# Altium project LPHR_WeatherStationPCB.PrjPcb (part 1 of 3)
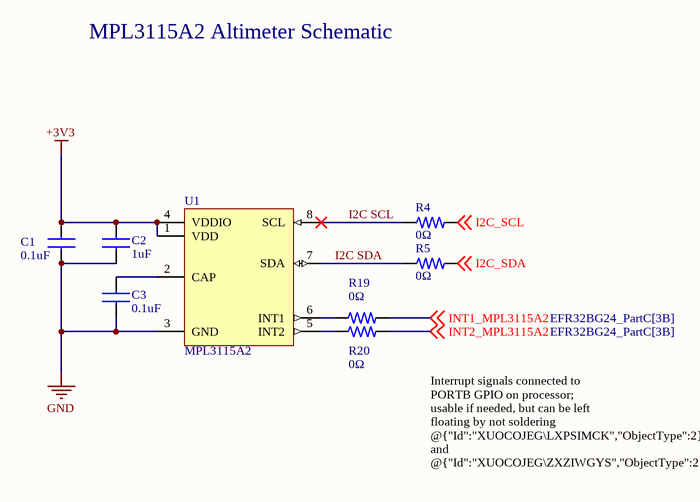
[diagram p0: MPL3115A2.SchDoc]
7 sheets, 99 parts. Net scope: flat (ports and power ports of the same name join across sheets).
Board file: PCB_WeatherStation.PcbDoc
Sheets:
  MPL3115A2.SchDoc
  AS7331.SchDoc
  Si7021.SchDoc
  BQ25570.SchDoc
  EFR32BG24_PartB.SchDoc
  EFR32BG24_PartC.SchDoc
  EFR32BG24_PartA.SchDoc

## Sheet MPL3115A2.SchDoc: LPEDT_Project_Schematic
size A; DocumentNumber: 1; Revision: 1; SheetNumber: 1; SheetTotal: 7

### Parts
C1  0.1uF  [C_0603]
C2  1uF  [C_0603]
C3  0.1uF  [C_0603]
R4  0Ω  [R_0603]
R5  0Ω  [R_0603]
R19  0Ω  [R_0603]
R20  0Ω  [R_0603]
U1  MPL3115A2  [U_MPL3115A2]

### Nets
+3V3: C1.1 C2.2 U1.1(VDD) U1.4(VDDIO)
GND: C1.2 C2.1 C3.2 U1.3(GND)
I2C SCL: R4.1 U1.8(SCL)
I2C SDA: R5.1 U1.7(SDA)
I2C_SCL: R4.2 ; off-sheet I2C_SCL
I2C_SDA: R5.2 ; off-sheet I2C_SDA
INT1_MPL3115A2: R19.2 ; off-sheet INT1_MPL3115A2
INT2_MPL3115A2: R20.2 ; off-sheet INT2_MPL3115A2
NetC3_1: C3.1 U1.2(CAP)
NetR19_1: R19.1 U1.6(INT1)
NetR20_1: R20.1 U1.5(INT2)

### Notes on the sheet
- MPL3115A2 Altimeter Schematic
- Interrupt signals connected to PORTB GPIO on processor; usable if needed, but can be left floating by not soldering @{"Id":"XUOCOJEG\LXPSIMCK","ObjectType":2} and @{"Id":"XUOCOJEG\ZXZIWGYS","ObjectType":2}.

### Library data of the parts
C1 C3 = C_0.1U_0603: CAP CER 0.1UF 10V X5R 0603; Manufacturer: KEMET; Manufacturer Part Number: C0603C104K8PAC7867; Dielectric Material: Ceramic; Supplier: Digikey; Supplier Part Number: 399-17573-1-ND; RoHS: Yes; Category: Ceramic Capacitors; Stock: 13122; Pricing: 1=0.18, 10=0.119, 50=0.075, 100=0.06, 500=0.04332, 1000=0.03833 (USD); Pins: 2; Capacitor Type: Ceramic; Reach SVHC Compliant: Yes; RoHS Compliant: Yes; ComponentLink1URL: https://datasheet.ciiva.com:443/pdfs/VipMasterIC/IC/KEME/KEME-S-A0007617622/KEME-S-A0007611556-1.pdf?src-supplier=IHS+Markit; ComponentLink1Description: https://datasheet.ciiva.com:443/pdfs/VipMasterIC/IC/KEME/KEME-S-A0007617622/KEME-S-A0007611556-1.pdf?src-supplier=IHS+Markit; ComponentLink2URL: https://api.kemet.com/component-edge/download/datasheet/C0603C104K8PAC7867.pdf?src-supplier=Digikey; ComponentLink2Description: https://api.kemet.com/component-edge/download/datasheet/C0603C104K8PAC7867.pdf?src-supplier=Digikey
C2 = C_1U_0603: CAP CER 1UF 10V X5R 0603; Manufacturer: Murata; Manufacturer Part Number: GRM188R61A105KA61D; Dielectric Material: Ceramic; Multilayer: Yes; Tolerance  (fill in as +-): 10%; Supplier: Digikey; Supplier Part Number: 490-1543-1-ND; RoHS: Yes; Category: Ceramic Capacitors; Stock: 1314759; Pricing: 1=0.12, 10=0.08, 50=0.048, 100=0.0378, 500=0.02794, 1000=0.02313 (USD); Mounting Technology: Surface Mount; Pins: 2; Package Shape: Rectangular; Case/Package: 0603; Terminal Finish: Nickel; Min Operating Temperature: -55°C; Max Operating Temperature: 85°C; JESD-609 Code: e3; Value: 1uF; Capacitor Type: Ceramic; Package Style: SMTMeter; Packaging: Tape and Reel; Tolerance (fill in as +-): 10%; Rated DC Voltage (URdc): 10V; Temperature Characteristics Code: X5R; Termination: Wraparound; Length: 1.6mm; Width: 0.8mm; Height: 0.8mm; Reach SVHC Compliant: Yes; RoHS Compliant: Yes; ComponentLink1URL: https://psearch.en.murata.com:443/capacitor/product/GRM188R61A105KA61%23.pdf?src-supplier=IHS+Markit; ComponentLink1Description: https://psearch.en.murata.com:443/capacitor/product/GRM188R61A105KA61%23.pdf?src-supplier=IHS+Markit; ComponentLink2URL: https://datasheet.ciiva.com/19476/1857381-19476568.pdf?src-supplier=Jameco; ComponentLink2Description: https://datasheet.ciiva.com/19476/1857381-19476568.pdf?src-supplier=Jameco; ComponentLink3URL: https://datasheet.ciiva.com/18102/getdatasheetpartid-85467-18102910.pdf?src-supplier=Verical; ComponentLink3Description: https://datasheet.ciiva.com/18102/getdatasheetpartid-85467-18102910.pdf?src-supplier=Verical; ComponentLink4URL: https://datasheet.ciiva.com/7719/608985-7719036.pdf?src-supplier=Element14; ComponentLink4Description: https://datasheet.ciiva.com/7719/608985-7719036.pdf?src-supplier=Element14; ComponentLink5URL: https://datasheet.ciiva.com/22706/608985-22706782.pdf?src-supplier=Element14; ComponentLink5Description: https://datasheet.ciiva.com/22706/608985-22706782.pdf?src-supplier=Element14; ComponentLink6URL: https://datasheet.ciiva.com/131/partnumbering-e-01-131742.pdf?src-supplier=Digikey; ComponentLink6Description: https://datasheet.ciiva.com/131/partnumbering-e-01-131742.pdf?src-supplier=Digikey; ComponentLink7URL: https://datasheet.ciiva.com/131/partnumbering-e-01-131741.pdf?src-supplier=Digikey; ComponentLink7Description: https://datasheet.ciiva.com/131/partnumbering-e-01-131741.pdf?src-supplier=Digikey; ComponentLink8URL: https://datasheet.ciiva.com/131/partnumbering-e-01-131743.pdf?src-supplier=Digikey; ComponentLink8Description: https://datasheet.ciiva.com/131/partnumbering-e-01-131743.pdf?src-supplier=Digikey; ComponentLink9URL: https://datasheet.ciiva.com/16199/product-16199724.pdf?src-supplier=Future+Electronics; ComponentLink9Description: https://datasheet.ciiva.com/16199/product-16199724.pdf?src-supplier=Future+Electronics
R4 R5 R19 R20 = R_0_0603: RES 0OHM 0.1W 0603; Manufacturer: Stackpole Electronics; Manufacturer Part Number: RMCF0603ZT0R00; Power: 100mW; Rated Temperature: 70°C; Value: 0R; Working Voltage: 75V; Package Height: 0.45mm; Package Length: 1.55mm; Package Width: 0.8mm; Reference Standard: AEC-Q200; Supplier: Digikey; Supplier Part Number: RMCF0603ZT0R00CT-ND; RoHS: Yes; Category: Chip SMD Resistors; Stock: 13173551; Pricing: 1=0.1, 10=0.013, 25=0.0096, 50=0.0072, 100=0.0051, 250=0.00408, 500=0.00328, 1000=0.00241 (USD); Mounting Technology: Surface Mount; Pins: 2; Package Shape: Rectangular; Case/Package: 0603; Terminal Finish: Nickel; Min Operating Temperature: -55°C; Max Operating Temperature: 155°C; JESD-609 Code: e3; Resistor Type: FIXED RESISTOR; Construction: Rectangular; Package Style: SMTMeter; Packaging: Tape and Reel; Technology: METAL GLAZE/THICK FILM; Termination: Wraparound; Reach SVHC Compliant: Yes; RoHS Compliant: Yes; ComponentLink1URL: https://datasheet.ciiva.com:443/pdfs/VipMasterIC/IC/SEIE/SEIE-S-A0007077258/SEIE-S-A0007077258-1.pdf?src-supplier=IHS+Markit; ComponentLink1Description: https://datasheet.ciiva.com:443/pdfs/VipMasterIC/IC/SEIE/SEIE-S-A0007077258/SEIE-S-A0007077258-1.pdf?src-supplier=IHS+Markit; ComponentLink2URL: https://datasheet.octopart.com/RMCF0603ZT0R00-Stackpole-Electronics-datasheet-11547379.pdf?src-supplier=Future+Electronics; ComponentLink2Description: https://datasheet.octopart.com/RMCF0603ZT0R00-Stackpole-Electronics-datasheet-11547379.pdf?src-supplier=Future+Electronics; ComponentLink3URL: https://www.seielect.com/catalog/SEI-Packaging.pdf?src-supplier=Avnet; ComponentLink3Description: https://www.seielect.com/catalog/SEI-Packaging.pdf?src-supplier=Avnet; ComponentLink4URL: https://www.seielect.com/catalog/SEI-Packaging.pdf?src-supplier=Arrow+Electronics; ComponentLink4Description: https://www.seielect.com/catalog/SEI-Packaging.pdf?src-supplier=Arrow+Electronics; ComponentLink5URL: https://www.seielect.com/catalog/SEI-Packaging.pdf?src-supplier=Verical; ComponentLink5Description: https://www.seielect.com/catalog/SEI-Packaging.pdf?src-supplier=Verical; ComponentLink6URL: https://datasheet.octopart.com/RMCF0603ZT0R00-Stackpole-Electronics-datasheet-154799224.pdf?src-supplier=Master+Electronics; ComponentLink6Description: https://datasheet.octopart.com/RMCF0603ZT0R00-Stackpole-Electronics-datasheet-154799224.pdf?src-supplier=Master+Electronics
U1 = U_MPL3115A2: Pressure Sensor 7.25PSI ~ 15.95PSI (50kPa ~ 110kPa) Absolute 24 b 8-TLGA

## Sheet AS7331.SchDoc: LPEDT_Project_Schematic
size A; Revision: 1; SheetNumber: 2; SheetTotal: 7
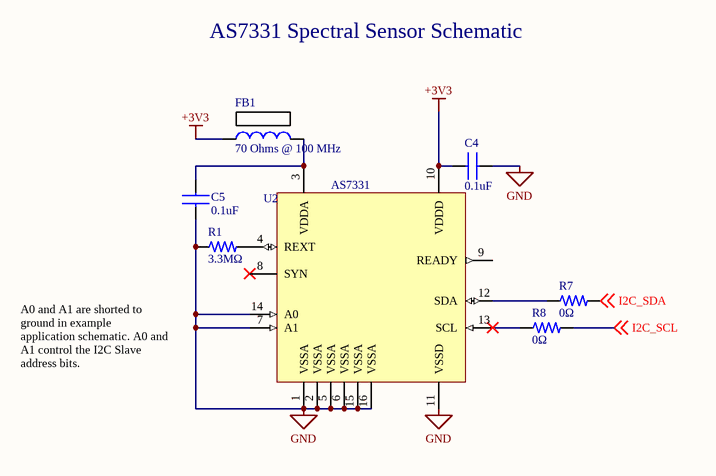
[diagram p1: AS7331.SchDoc]

### Parts
C4  0.1uF  [C_0603]
C5  0.1uF  [C_0603]
FB1  70 Ohms @ 100 MHz  [FB_0603]
R1  3.3MΩ  [R_0603]
R7  0Ω  [R_0603]
R8  0Ω  [R_0603]
U2  AS7331  [U_AS7331]

### Nets
+3V3: C4.2 FB1.1 U2.10(VDDD)
GND: C4.1 C5.2 R1.1 U2.1(VSSA) U2.2(VSSA) U2.5(VSSA) U2.6(VSSA) U2.7(A1) U2.11(VSSD) U2.14(A0) U2.15(VSSA) U2.16(VSSA)
I2C_SCL: R8.2 ; off-sheet I2C_SCL
I2C_SDA: R7.2 ; off-sheet I2C_SDA
NetC5_1: C5.1 FB1.2 U2.3(VDDA)
NetR1_2: R1.2 U2.4(REXT)
NetR7_1: R7.1 U2.12(SDA)
NetR8_1: R8.1 U2.13(SCL)

Not connected (* = marked no-connect by the designer): U2 8(SYN)* 9(READY)

### Notes on the sheet
- AS7331 Spectral Sensor Schematic
- A0 and A1 are shorted to ground in example application schematic. A0 and A1 control the I2C Slave address bits.

### Library data of the parts
C4 C5 = C_0.1U_0603: as C1 on sheet MPL3115A2; Supplier: Digikey; Supplier Part Number: 399-17573-1-ND; RoHS: Yes; Category: Ceramic Capacitors; Stock: 13122; Pricing: 1=0.18, 10=0.119, 50=0.075, 100=0.06, 500=0.04332, 1000=0.03833 (USD); Pins: 2; Capacitor Type: Ceramic; Reach SVHC Compliant: Yes; RoHS Compliant: Yes; ComponentLink1URL: https://datasheet.ciiva.com:443/pdfs/VipMasterIC/IC/KEME/KEME-S-A0007617622/KEME-S-A0007611556-1.pdf?src-supplier=IHS+Markit; ComponentLink1Description: https://datasheet.ciiva.com:443/pdfs/VipMasterIC/IC/KEME/KEME-S-A0007617622/KEME-S-A0007611556-1.pdf?src-supplier=IHS+Markit; ComponentLink2URL: https://api.kemet.com/component-edge/download/datasheet/C0603C104K8PAC7867.pdf?src-supplier=Digikey; ComponentLink2Description: https://api.kemet.com/component-edge/download/datasheet/C0603C104K8PAC7867.pdf?src-supplier=Digikey
FB1 = BLM18SG700TN1D: Ferrite Chip, 1 Function(s), 4A, 2 Pin(s); Manufacturer: Murata; DC Resistance-Max: 20mR; Clock Frequency: 100MHz; Channels: 1; Output Impedance: 70R; Supplier: Digikey; Supplier Part Number: 490-5224-1-ND; Manufacturer Part Number: BLM18SG700TN1D; RoHS: Yes; Category: Ferrite Beads and Chips; Stock: 330015; Pricing: 1=0.13, 10=0.109, 25=0.0848, 50=0.0702, 100=0.0605, 250=0.0484, 500=0.04356, 1000=0.03631, 5000=0.03389 (USD); Mounting Technology: Surface Mount; Material: Ferrite; Case Code: 0603; Terminal Finish: Tin; Min Operating Temperature: -55°C; Max Operating Temperature: 125°C; JESD-609 Code: e3; Construction: Chip Bead; Filter Type: FERRITE CHIP; Min Frequency: 100MHz; Packaging: Tape and Reel; Current Rating: 4A; Length: 1.6mm; Width: 0.8mm; Height: 0.5mm; Reach SVHC Compliant: Yes; RoHS Compliant: Yes; ComponentLink1URL: https://datasheet.ciiva.com:443/pdfs/VipMasterIC/IC/MURE/MURE-S-A0008515766/MURE-S-A0008515869-1.pdf?src-supplier=IHS+Markit; ComponentLink1Description: https://datasheet.ciiva.com:443/pdfs/VipMasterIC/IC/MURE/MURE-S-A0008515766/MURE-S-A0008515869-1.pdf?src-supplier=IHS+Markit; ComponentLink2URL: https://datasheet.ciiva.com/41449/001171727-da-01-en-chip-drossel0603-70r-4000ma-1-6x0-8mm-41449356.pdf?src-supplier=Conrad; ComponentLink2Description: https://datasheet.ciiva.com/41449/001171727-da-01-en-chip-drossel0603-70r-4000ma-1-6x0-8mm-41449356.pdf?src-supplier=Conrad; ComponentLink3URL: https://datasheet.ciiva.com/41449/001172316-da-01-en-drossel-0603-70r-1-6x0-8mm-10000st-41449678.pdf?src-supplier=Conrad; ComponentLink3Description: https://datasheet.ciiva.com/41449/001172316-da-01-en-drossel-0603-70r-1-6x0-8mm-10000st-41449678.pdf?src-supplier=Conrad; ComponentLink4URL: https://datasheet.ciiva.com/8021/5151-8021530.pdf?src-supplier=Element14; ComponentLink4Description: https://datasheet.ciiva.com/8021/5151-8021530.pdf?src-supplier=Element14; ComponentLink5URL: https://datasheet.ciiva.com/14122/blm-series-eng-tds-14122901.pdf?src-supplier=Distrelec; ComponentLink5Description: https://datasheet.ciiva.com/14122/blm-series-eng-tds-14122901.pdf?src-supplier=Distrelec; ComponentLink6URL: https://datasheet.ciiva.com/8021/5151-8021529.pdf?src-supplier=Element14; ComponentLink6Description: https://datasheet.ciiva.com/8021/5151-8021529.pdf?src-supplier=Element14; ComponentLink7URL: https://datasheet.ciiva.com/6212/l0110s0100blm18s-6212357.pdf?src-supplier=Digikey; ComponentLink7Description: https://datasheet.ciiva.com/6212/l0110s0100blm18s-6212357.pdf?src-supplier=Digikey
R1 = R_3.3M_0603: RES 3.3MOHM 0.1W 0603; Manufacturer: Yageo; Manufacturer Part Number: RC0603FR-073M3L; Tolerance: 1%; Additional Feature: LASER TRIMMABLE; Power: 100mW; Rated Temperature: 70°C; Value: 3.3MR; Temperature Coefficient: 100ppm/°C; Working Voltage: 75V; Package Height: 0.45mm; Package Length: 1.6mm; Package Width: 0.8mm; Supplier: Digikey; Supplier Part Number: 13-RC0603FR-073M3LCT-ND; RoHS: Yes; Category: Chip SMD Resistors; Stock: 44730; Pricing: 1=0.1, 10=0.019, 50=0.0112, 100=0.0093, 500=0.00622, 1000=0.00532 (USD); Mounting Technology: Surface Mount; Pins: 2; Package Shape: Rectangular; Case/Package: 0603; Terminal Finish: Nickel; Min Operating Temperature: -55°C; Max Operating Temperature: 155°C; JESD-609 Code: e3; Resistor Type: FIXED RESISTOR; Construction: Chip; Package Style: SMTMeter; Packaging: Tape and Reel; Technology: METAL GLAZE/THICK FILM; Termination: Wraparound; Reach SVHC Compliant: Yes; RoHS Compliant: Yes; ComponentLink1URL: https://datasheet.ciiva.com:443/pdfs/VipMasterIC/IC/YAGO/YAGO-S-A0008145938/YAGO-S-A0008145938-1.pdf?src-supplier=IHS+Markit; ComponentLink1Description: https://datasheet.ciiva.com:443/pdfs/VipMasterIC/IC/YAGO/YAGO-S-A0008145938/YAGO-S-A0008145938-1.pdf?src-supplier=IHS+Markit; ComponentLink2URL: https://datasheet.ciiva.com/7746/443971-7746349.pdf?src-supplier=Element14; ComponentLink2Description: https://datasheet.ciiva.com/7746/443971-7746349.pdf?src-supplier=Element14; ComponentLink3URL: https://datasheet.ciiva.com/7746/443971-7746350.pdf?src-supplier=Element14; ComponentLink3Description: https://datasheet.ciiva.com/7746/443971-7746350.pdf?src-supplier=Element14
R7 R8 = R_0_0603: as R4 on sheet MPL3115A2; Supplier: Digikey; Supplier Part Number: RMCF0603ZT0R00CT-ND; RoHS: Yes; Category: Chip SMD Resistors; Stock: 13173551; Pricing: 1=0.1, 10=0.013, 25=0.0096, 50=0.0072, 100=0.0051, 250=0.00408, 500=0.00328, 1000=0.00241 (USD); Mounting Technology: Surface Mount; Pins: 2; Package Shape: Rectangular; Case/Package: 0603; Terminal Finish: Nickel; Min Operating Temperature: -55°C; Max Operating Temperature: 155°C; JESD-609 Code: e3; Resistor Type: FIXED RESISTOR; Construction: Rectangular; Package Style: SMTMeter; Packaging: Tape and Reel; Technology: METAL GLAZE/THICK FILM; Termination: Wraparound; Reach SVHC Compliant: Yes; RoHS Compliant: Yes; ComponentLink1URL: https://datasheet.ciiva.com:443/pdfs/VipMasterIC/IC/SEIE/SEIE-S-A0007077258/SEIE-S-A0007077258-1.pdf?src-supplier=IHS+Markit; ComponentLink1Description: https://datasheet.ciiva.com:443/pdfs/VipMasterIC/IC/SEIE/SEIE-S-A0007077258/SEIE-S-A0007077258-1.pdf?src-supplier=IHS+Markit; ComponentLink2URL: https://datasheet.octopart.com/RMCF0603ZT0R00-Stackpole-Electronics-datasheet-11547379.pdf?src-supplier=Future+Electronics; ComponentLink2Description: https://datasheet.octopart.com/RMCF0603ZT0R00-Stackpole-Electronics-datasheet-11547379.pdf?src-supplier=Future+Electronics; ComponentLink3URL: https://www.seielect.com/catalog/SEI-Packaging.pdf?src-supplier=Avnet; ComponentLink3Description: https://www.seielect.com/catalog/SEI-Packaging.pdf?src-supplier=Avnet; ComponentLink4URL: https://www.seielect.com/catalog/SEI-Packaging.pdf?src-supplier=Arrow+Electronics; ComponentLink4Description: https://www.seielect.com/catalog/SEI-Packaging.pdf?src-supplier=Arrow+Electronics; ComponentLink5URL: https://www.seielect.com/catalog/SEI-Packaging.pdf?src-supplier=Verical; ComponentLink5Description: https://www.seielect.com/catalog/SEI-Packaging.pdf?src-supplier=Verical; ComponentLink6URL: https://datasheet.octopart.com/RMCF0603ZT0R00-Stackpole-Electronics-datasheet-154799224.pdf?src-supplier=Master+Electronics; ComponentLink6Description: https://datasheet.octopart.com/RMCF0603ZT0R00-Stackpole-Electronics-datasheet-154799224.pdf?src-supplier=Master+Electronics
U2 = U_AS7331: Optical Sensor Ultraviolet (UV) 260nm ~ 360nm I2C 16-TFLGA Module; Manufacturer: Osram Opto; Manufacturer Part Number: AS7331-AQFMOLGA16LFT&R; Supplier: Digikey; Supplier Part Number: 4991-AS7331_MOLGA16LFT&RDPCT-ND; RoHS: No; Stock: 1805; Pricing: 1=10.86, 10=8.688, 25=8.0364, 100=6.9504, 500=6.51602 (USD)

## Sheet Si7021.SchDoc: LPEDT_Project_Schematic
size A; Revision: 1; SheetNumber: 3; SheetTotal: 7
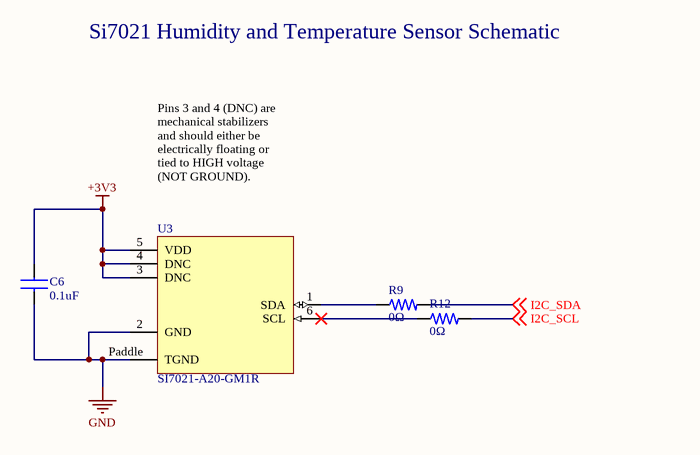
[diagram p2: Si7021.SchDoc]

### Parts
C6  0.1uF  [C_0603]
R9  0Ω  [R_0603]
R12  0Ω  [R_0603]
U3  SI7021-A20-GM1R  [U_Si7021]

### Nets
+3V3: C6.1 U3.3(DNC) U3.4(DNC) U3.5(VDD)
GND: C6.2 U3.2(GND) U3.Paddle(TGND)
I2C_SCL: R12.2 ; off-sheet I2C_SCL
I2C_SDA: R9.2 ; off-sheet I2C_SDA
NetR9_1: R9.1 U3.1(SDA)
NetR12_1: R12.1 U3.6(SCL)

### Notes on the sheet
- Si7021 Humidity and Temperature Sensor Schematic
- Pins 3 and 4 (DNC) are mechanical stabilizers and should either be electrically floating or tied to HIGH voltage (NOT GROUND).

### Library data of the parts
C6 = C_0.1U_0603: as C1 on sheet MPL3115A2; Supplier: Digikey; Supplier Part Number: 399-17573-1-ND; RoHS: Yes; Category: Ceramic Capacitors; Stock: 13122; Pricing: 1=0.18, 10=0.119, 50=0.075, 100=0.06, 500=0.04332, 1000=0.03833 (USD); Pins: 2; Capacitor Type: Ceramic; Reach SVHC Compliant: Yes; RoHS Compliant: Yes; ComponentLink1URL: https://datasheet.ciiva.com:443/pdfs/VipMasterIC/IC/KEME/KEME-S-A0007617622/KEME-S-A0007611556-1.pdf?src-supplier=IHS+Markit; ComponentLink1Description: https://datasheet.ciiva.com:443/pdfs/VipMasterIC/IC/KEME/KEME-S-A0007617622/KEME-S-A0007611556-1.pdf?src-supplier=IHS+Markit; ComponentLink2URL: https://api.kemet.com/component-edge/download/datasheet/C0603C104K8PAC7867.pdf?src-supplier=Digikey; ComponentLink2Description: https://api.kemet.com/component-edge/download/datasheet/C0603C104K8PAC7867.pdf?src-supplier=Digikey
R9 R12 = R_0_0603: as R4 on sheet MPL3115A2; Supplier: Digikey; Supplier Part Number: RMCF0603ZT0R00CT-ND; RoHS: Yes; Category: Chip SMD Resistors; Stock: 13173551; Pricing: 1=0.1, 10=0.013, 25=0.0096, 50=0.0072, 100=0.0051, 250=0.00408, 500=0.00328, 1000=0.00241 (USD); Mounting Technology: Surface Mount; Pins: 2; Package Shape: Rectangular; Case/Package: 0603; Terminal Finish: Nickel; Min Operating Temperature: -55°C; Max Operating Temperature: 155°C; JESD-609 Code: e3; Resistor Type: FIXED RESISTOR; Construction: Rectangular; Package Style: SMTMeter; Packaging: Tape and Reel; Technology: METAL GLAZE/THICK FILM; Termination: Wraparound; Reach SVHC Compliant: Yes; RoHS Compliant: Yes; ComponentLink1URL: https://datasheet.ciiva.com:443/pdfs/VipMasterIC/IC/SEIE/SEIE-S-A0007077258/SEIE-S-A0007077258-1.pdf?src-supplier=IHS+Markit; ComponentLink1Description: https://datasheet.ciiva.com:443/pdfs/VipMasterIC/IC/SEIE/SEIE-S-A0007077258/SEIE-S-A0007077258-1.pdf?src-supplier=IHS+Markit; ComponentLink2URL: https://datasheet.octopart.com/RMCF0603ZT0R00-Stackpole-Electronics-datasheet-11547379.pdf?src-supplier=Future+Electronics; ComponentLink2Description: https://datasheet.octopart.com/RMCF0603ZT0R00-Stackpole-Electronics-datasheet-11547379.pdf?src-supplier=Future+Electronics; ComponentLink3URL: https://www.seielect.com/catalog/SEI-Packaging.pdf?src-supplier=Avnet; ComponentLink3Description: https://www.seielect.com/catalog/SEI-Packaging.pdf?src-supplier=Avnet; ComponentLink4URL: https://www.seielect.com/catalog/SEI-Packaging.pdf?src-supplier=Arrow+Electronics; ComponentLink4Description: https://www.seielect.com/catalog/SEI-Packaging.pdf?src-supplier=Arrow+Electronics; ComponentLink5URL: https://www.seielect.com/catalog/SEI-Packaging.pdf?src-supplier=Verical; ComponentLink5Description: https://www.seielect.com/catalog/SEI-Packaging.pdf?src-supplier=Verical; ComponentLink6URL: https://datasheet.octopart.com/RMCF0603ZT0R00-Stackpole-Electronics-datasheet-154799224.pdf?src-supplier=Master+Electronics; ComponentLink6Description: https://datasheet.octopart.com/RMCF0603ZT0R00-Stackpole-Electronics-datasheet-154799224.pdf?src-supplier=Master+Electronics
U3 = U_Si7021: Humidity, Temperature 0 ~ 100% RH I2C ±3% RH 18 s Surface Mount; Supplier 1: Digikey; Supplier Part Number 1: 336-4380-1-ND

## Sheet BQ25570.SchDoc: LPEDT_Project_Schematic
size A; Revision: 1; SheetNumber: 4; SheetTotal: 7
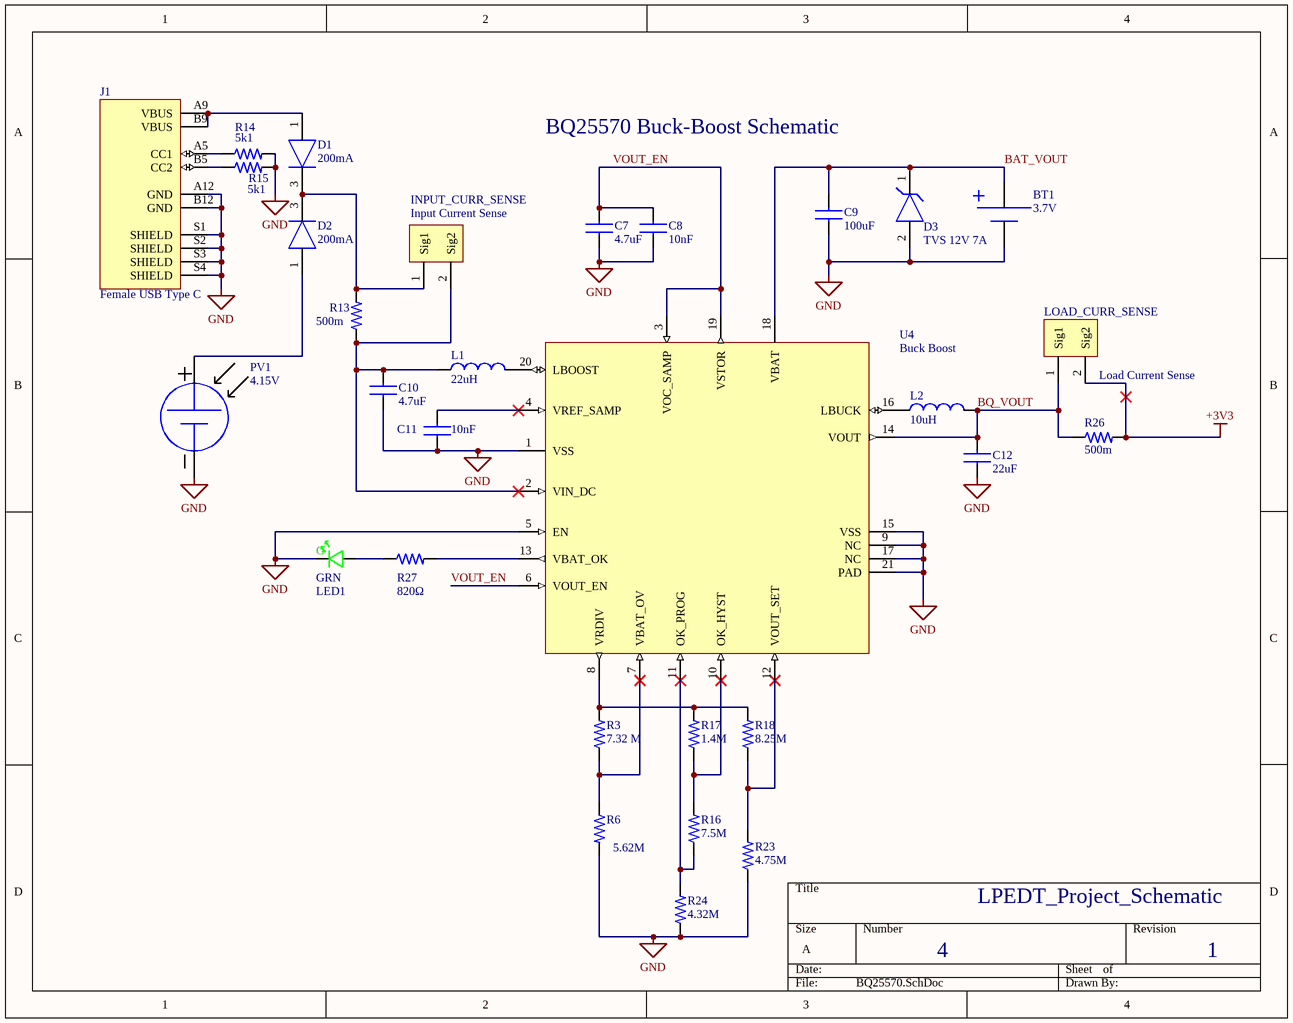
[diagram p3: BQ25570.SchDoc]

### Parts
BT1  3.7V  [BT_25.4mmCoinCell]
C7  4.7uF  [C_0603]
C8  10nF  [C_0603]
C9  100uF  [C_0805]
C10  4.7uF  [C_0603]
C11  10nF  [C_0603]
C12  22uF  [C_0603]
D1  200mA  [SOT95P237X111-3N]
D2  200mA  [SOT95P237X111-3N]
D3  TVS 12V 7A  [D_TVS]
INPUT_CURR_SENSE  Input Current Sense  [TP_2PIN_MALE]
J1  Female USB Type C  [GCT_USB4125-GF-A_REVA2]
L1  22uH  [L_2828x30]
L2  10uH  [L_2828_15]
LED1  GRN  [LED_0603]
LOAD_CURR_SENSE  Load Current Sense  [TP_2PIN_MALE]
PV1  4.15V  [PV_Custom]
R3  7.32 M  [R_0603]
R6  5.62M  [R_0603]
R13  500m  [R_0603]
R14  5k1  [R_0603]
R15  5k1  [R_0603]
R16  7.5M  [R_0603]
R17  1.4M  [R_0603]
R18  8.25M  [R_0603]
R23  4.75M  [R_0603]
R24  4.32M  [R_0603]
R26  500m  [R_0603]
R27  820Ω  [R_0603]
U4  Buck Boost  [U_20QFN_3.5x3.5]

### Nets
+3V3: LOAD_CURR_SENSE.2(Sig2) R26.2
GND: BT1.2 C7.2 C8.2 C9.2 C10.2 C11.2 C12.2 D3.2 J1.A12(GND) J1.B12(GND) J1.S1(SHIELD) J1.S2(SHIELD) J1.S3(SHIELD) J1.S4(SHIELD) LED1.C PV1.2 R6.2 R14.2 R15.2 R23.1 R24.1 U4.1(VSS) U4.5(EN) U4.9(NC) U4.15(VSS) U4.17(NC) U4.21(PAD)
BAT_VOUT: BT1.1 C9.1 D3.1 U4.18(VBAT)
BQ_VOUT: C12.1 L2.2 LOAD_CURR_SENSE.1(Sig1) R26.1 U4.14(VOUT)
VOUT_EN: C7.1 C8.1 U4.3(VOC_SAMP) U4.6(VOUT_EN) U4.19(VSTOR)
NetC10_1: C10.1 INPUT_CURR_SENSE.2(Sig2) L1.1 R13.1 U4.2(VIN_DC)
NetC11_1: C11.1 U4.4(VREF_SAMP)
NetD1_1: D1.1(ANODE) J1.A9(VBUS) J1.B9(VBUS)
NetD1_3: D1.3(CATHODE) D2.3(CATHODE) INPUT_CURR_SENSE.1(Sig1) R13.2
NetD2_1: D2.1(ANODE) PV1.1
NetJ1_A5: J1.A5(CC1) R14.1
NetJ1_B5: J1.B5(CC2) R15.1
NetL1_2: L1.2 U4.20(LBOOST)
NetL2_1: L2.1 U4.16(LBUCK)
NetLED1_A: LED1.A R27.1
NetR3_1: R3.1 R6.1 U4.7(VBAT_OV)
NetR3_2: R3.2 R17.2 R18.2 U4.8(VRDIV)
NetR16_1: R16.1 R24.2 U4.11(OK_PROG)
NetR16_2: R16.2 R17.1 U4.10(OK_HYST)
NetR18_1: R18.1 R23.2 U4.12(VOUT_SET)
NetR27_2: R27.2 U4.13(VBAT_OK)

### Notes on the sheet
- BQ25570 Buck-Boost Schematic
- (in symbol LED_GREEN_0603) G